# Altium schematic sheet CW340_FPGA_XADC.SchDoc: FPGA - Thermal + XADC
size Letter; DocumentNumber: .; Revision: .; SheetNumber: 17; SheetTotal: 31; SheetApproved: Yes
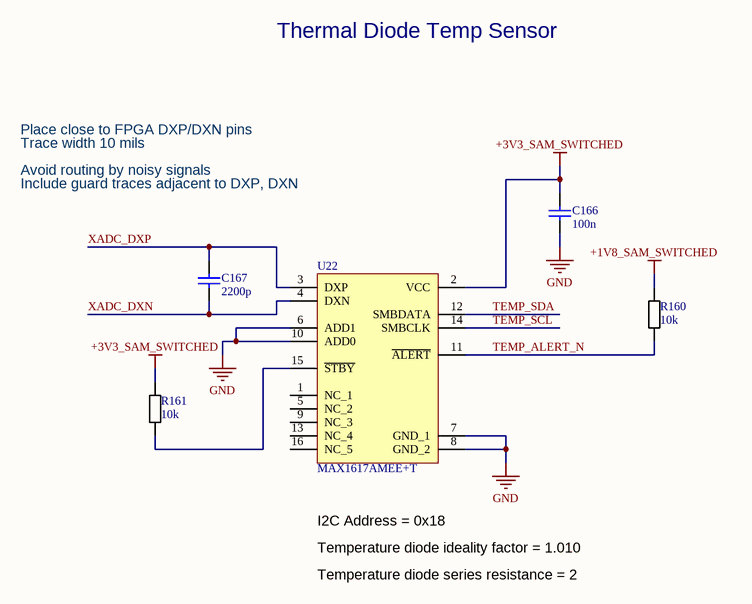
[diagram p0: CW340_FPGA_XADC.SchDoc]

## Parts
C166  100n  [CAPC0402_M]
C167  2200p  [CAPC0402_M]
R160  10k  [RESC1005X40N]
R161  10k  [RESC1005X40N]
U22  Temp Diode sensor interface  [SOP64P600X175-16N]  (value not drawn)

## Nets
+1V8_SAM_SWITCHED: R160.1
+3V3_SAM_SWITCHED: C166.1 R161.1 U22.2(VCC)
GND: C166.2 U22.6(ADD1) U22.7(GND_1) U22.8(GND_2) U22.10(ADD0)
TEMP_ALERT_N: R160.2 U22.11(~{ALERT})
TEMP_SCL: U22.14(SMBCLK)
TEMP_SDA: U22.12(SMBDATA)
XADC_DXN: C167.2 U22.4(DXN)
XADC_DXP: C167.1 U22.3(DXP)
NetR161_2: R161.2 U22.15(~{STBY})

Not connected (* = marked no-connect by the designer): U22 1(NC_1) 5(NC_2) 9(NC_3) 13(NC_4) 16(NC_5)

## Notes on the sheet
- Thermal Diode Temp Sensor
- Trace width 10 mils
- Place close to FPGA DXP/DXN pins
- Include guard traces adjacent to DXP, DXN
- Avoid routing by noisy signals
- I2C Address = 0x18
- Temperature diode ideality factor = 1.010
- Temperature diode series resistance = 2
- Title:
- Date:
- Rev:
- Time:
- Project:
- Sheet
- of
- License:
- Copyright © NewAE Technology Inc.
- Approved:
- NewAE.com
- File:

## Library data of the parts
C166 = CCHIP-100n-0402: 100n, 0402; Manufacture Part Number 1: CGA2B3X7R1V104K050BB; Component Group: Capacitor; Case-EIA: 0402; Part Number: CCHIP-100n-0402; Footprint: 0402; Pin Count: 2; Value: 100n; Mounting Technology: SMT; Component Kind: Standard; Component Type: Standard; Supplier 1: Digi-Key; Supplier Part Number 1: 445-6901-1-ND
C167 = CCHIP-2200P-0402-50V: CAP CER 2200PF 50V X7R 0402; Manufacture 1: Taiyo Yuden; Manufacture Part Number 1: UMK105B7222KV-F; Component Group: Capacitor; Case-EIA: 0402; Case-Metric: 1005; Tolerance: ±10%; PP Material Stack: 0; Part Number: CCHIP-2200P-0402-50V; Footprint: 0402; Pin Count: 2; Supplier 1: Digi-Key; Supplier Part Number 1: 587-1221-1-ND; Value: 2200p; Rated Voltage: 50V; Mounting Technology: SMT; Component Kind: Standard; Component Type: Standard; PP Rotation: 0
R160 R161 = RCHIP-10K-0402: 10k res, 0402, 1%, 1/16W; Manufacture 1: Yageo; Manufacture Part Number 1: RC0402FR-0710KL; Component Group: Resistor; Case-EIA: 0402; Case-Metric: 1005; Rated Power: 0.063W; Rated Voltage: 75VDC; Part Number: RCHIP-10K-0402; Footprint: 0402; Pin Count: 2; Supplier 1: Digi-Key; Supplier Part Number 1: 311-10.0KLRCT-ND; Value: 10k; Tolerance: 1%; Mounting Technology: SMT; Temperature Range: -55C to 155C; Component Kind: Standard; Component Type: Standard
U22 = MAX1617AMEE+T: SENSOR DIGITAL -55C-125C 16QSOP; Manufacture 1: Maxim Integrated; Max Supply Voltage: 5.5V; Min Supply Voltage: 3V; Interface: I2C,SMBus,2-Wire; Resolution: 7b; Operating Supply Current: 120uA; Output Type: Digital,I2C; Component Group: Analog IC; PP Material Stack: 0; Supplier 1: Digi-Key; RoHS: Yes; Category: Temperature and Humidity Sensors; Stock 1: 2966; Pricing 1: 1=8.93000, 10=8.06900, 25=7.69360, 100=6.68030, 500=5.81716, 1000=5.42100 (USD); Case/Package: QSOP; Number of Pins: 16; Contact Plating: Tin,Matte; Min Operating Temperature: -55°C; Max Operating Temperature: 125°C; Package Quantity: 2500; Packaging: Tape and Reel; Max Supply Voltage (DC): 5.5V; Min Supply Voltage (DC): 3V; Radiation Hardening: No; REACH SVHC: Unknown; Lead Free: Lead Free; ComponentLink3URL: https://datasheet.ciiva.com/16635/max1617a-16635403.pdf?src-supplier=Avnet+Europe; ComponentLink3Description: https://datasheet.ciiva.com/16635/max1617a-16635403.pdf?src-supplier=Avnet+Europe; ComponentLink4URL: https://datasheet.ciiva.com/16635/max1617a-16635599.pdf?src-supplier=Avnet+Europe; ComponentLink4Description: https://datasheet.ciiva.com/16635/max1617a-16635599.pdf?src-supplier=Avnet+Europe; .Checked SCH: *; .Checked PCB: *; Supplier Part Number 1: MAX1617AMEE+TTR-ND; Manufacturer Part Number: MAX1617AMEE+T; Part Number: MAX1617AMEE+T; Footprint: QSOP-16; Manufacture Part Number 1: MAX1617AMEE+T; Pin Count: 16; Mounting Technology: SMT; Component Kind: Standard; Component Type: Standard; PP Rotation: 0